# Altium schematic sheet CPU.SchDoc: CPU
size A4; CheckedBy: *Goran Vidakovic; CompanyName: Sigmoid DOO, Novi Sad, Serbia; DrawnBy: *Nikolina Bratic; SheetNumber: 3; SheetTotal: 4
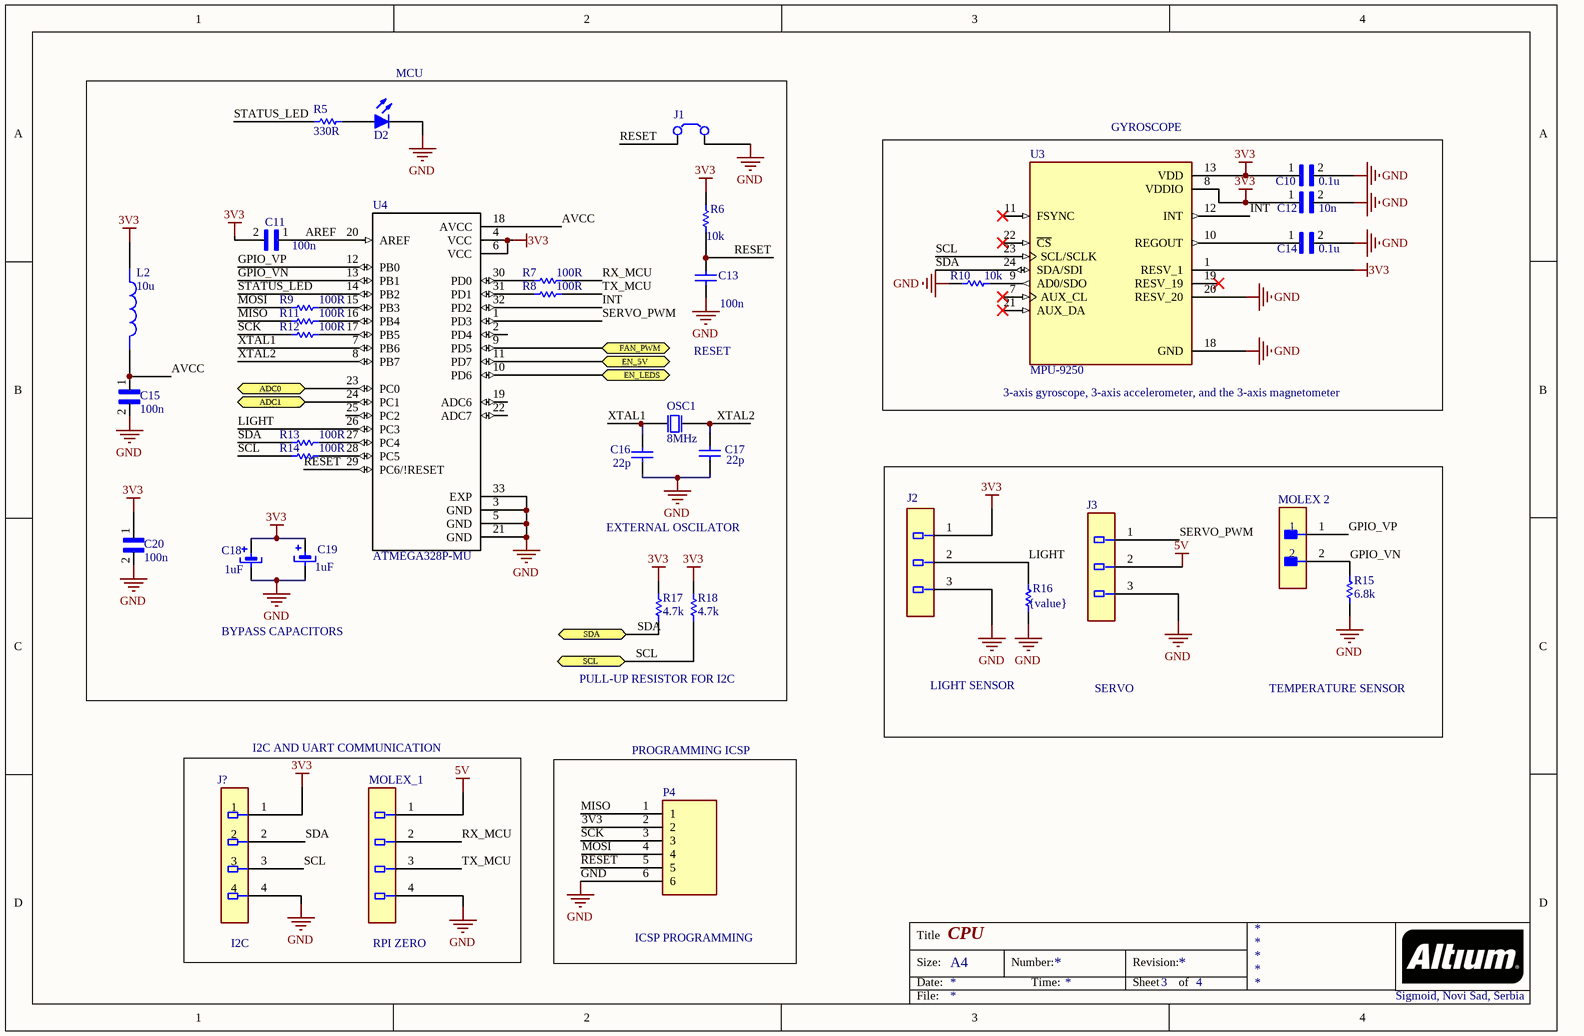
[diagram p0: CPU.SchDoc]

## Parts
C10  value 0.1u  [CAPC0402X22N]  (hidden comment: GRM0225C1E4R6CA03L_1)
C11  value 100n  [CAPC0402X22N]  (hidden comment: GRM0225C1E4R6CA03L_1)
C12  value 10n  [CAPC0402X22N]  (hidden comment: GRM0225C1E4R6CA03L_1)
C13  value 100n  [Capacitor SMD 0603]  (hidden comment: SMD Capacitor)
C14  value 0.1u  [CAPC0402X22N]  (hidden comment: GRM0225C1E4R6CA03L_1)
C15  value 100n  [CAPC0402X22N]  (hidden comment: GRM0225C1E4R6CA03L_1)
C16  value 22p  [Capacitor SMD 0603]  (hidden comment: SMD Capacitor)
C17  value 22p  [Capacitor SMD 0603]  (hidden comment: SMD Capacitor)
C18  value 1uF  [B Size Capacitor]  (hidden comment: SMD Tantalum Capacitor (B))
C19  value 1uF  [B Size Capacitor]  (hidden comment: SMD Tantalum Capacitor (B))
C20  value 100n  [CAPC0402X22N]  (hidden comment: GRM0225C1E4R6CA03L_1)
D2  SMD LED  [SMD LED Diode]  (value not drawn)
J1  Jumper 2 Pole  [Jumper 2 Pole]  (value not drawn)
J2  53253-0370  [Molex_53253-0370_0]  (value not drawn)
J3  SERVO CONNECTOR  [Molex_22-05-1032_0]  (value not drawn)
J?  Connector 4x1 1.27  [Harwin_Inc._M50-3930442_Recommended_Land_Pattern]  (value not drawn)
L2  value 10u  [INDC1608X95N]  (hidden comment: XAL6060-472ME)
MOLEX_1  292161-4  [TE_292161-4_0]  (value not drawn)
MOLEX_2  CONN HEADER VERT 2POS 2MM  [TE_Connectivity_0_MFG]  (value not drawn)
OSC1  value 8MHz  [XTAL_ECS-080-18-23G-JGN-TR]  (hidden comment: SMD Crystal Oscillator)
P4  ICSP PROGRAMMING  [ICSP Programming 6X1 (2mm)]
R5  value 330R  [RESC1005X35N]  (hidden comment: SMD Resistor)
R6  SMD Resistor  [Resistor SMD 0603]  (value not drawn)
R7  value 100R  [Resistor SMD 0603]  (hidden comment: SMD Resistor)
R8  value 100R  [Resistor SMD 0603]  (hidden comment: SMD Resistor)
R9  value 100R  [Resistor SMD 0603]  (hidden comment: SMD Resistor)
R10  value 10k  [Resistor SMD 0603]  (hidden comment: SMD Resistor)
R11  value 100R  [Resistor SMD 0603]  (hidden comment: SMD Resistor)
R12  value 100R  [Resistor SMD 0603]  (hidden comment: SMD Resistor)
R13  value 100R  [Resistor SMD 0603]  (hidden comment: SMD Resistor)
R14  value 100R  [Resistor SMD 0603]  (hidden comment: SMD Resistor)
R15  value 6.8k  [RESC1005X35N]  (hidden comment: SMD Resistor)
R16  value {value}  [Resistor SMD 0603]  (hidden comment: SMD Resistor)
R17  value 4.7k  [RESC1005X35N]  (hidden comment: SMD Resistor)
R18  value 4.7k  [RESC1005X35N]  (hidden comment: SMD Resistor)
U3  MPU-9250  [QFN40P300X300X105-24N]
U4  ATMEGA328P-MU  [QFN50P500X500X100-33N]

## Blocks framed on the sheet
GYROSCOPE: C10 C12 C14 R10 U3
PROGRAMMING ICSP: P4

## Ports
ADC0, ADC1, EN_5V, EN_LEDS, FAN_PWM, SCL, SDA

## Nets
3V3: C10.1 C11.2 C12.1 C18.1 C19.1 C20.1 J2.1 J?.1 L2.1 P4.2 R6.2 R17.2 R18.2 U3.1(RESV_1) U3.8(VDDIO) U3.13(VDD) U4.4(VCC) U4.6(VCC)
5V: J3.2 MOLEX_1.1
GND: C10.2 C12.2 C13.1 C14.2 C15.2 C16.1 C17.1 C18.2 C19.2 C20.2 D2.2(K) J1.2 J2.3 J3.3 J?.4 MOLEX_1.4 P4.6 R10.1 R15.1 R16.1 U3.18(GND) U3.20(RESV_20) U4.3(GND) U4.5(GND) U4.21(GND) U4.33(EXP)
ADC0: U4.23(PC0) ; port ADC0
ADC1: U4.24(PC1) ; port ADC1
AREF: C11.1 U4.20(AREF)
AVCC: C15.1 L2.2 U4.18(AVCC)
EN_5V: U4.11(PD7) ; port EN_5V
EN_LEDS: U4.10(PD6) ; port EN_LEDS
FAN_PWM: U4.9(PD5) ; port FAN_PWM
GPIO_VN: MOLEX_2.2 R15.2 U4.13(PB1)
GPIO_VP: MOLEX_2.1 U4.12(PB0)
INT: U3.12(INT) U4.32(PD2)
LIGHT: J2.2 R16.2 U4.26(PC3)
MISO: P4.1 R11.1
MOSI: P4.4 R9.1
RESET: C13.2 J1.1 P4.5 R6.1 U4.29(PC6/!RESET)
RX_MCU: MOLEX_1.2 R7.2
SCK: P4.3 R12.1
SCL: J?.3 R14.1 R18.1 U3.23(SCL/SCLK) ; port SCL
SDA: J?.2 R13.1 R17.1 U3.24(SDA/SDI) ; port SDA
SERVO_PWM: J3.1 U4.1(PD3)
STATUS_LED: R5.2 U4.14(PB2)
TX_MCU: MOLEX_1.3 R8.2
XTAL1: C16.2 OSC1.1(XTAL1) U4.7(PB6)
XTAL2: C17.2 OSC1.2(XTAL2) U4.8(PB7)
NetC14_1: C14.1 U3.10(REGOUT)
NetD2_1: D2.1(A) R5.1
NetR7_1: R7.1 U4.30(PD0)
NetR8_1: R8.1 U4.31(PD1)
NetR9_2: R9.2 U4.15(PB3)
NetR10_2: R10.2 U3.9(AD0/SDO)
NetR11_2: R11.2 U4.16(PB4)
NetR12_2: R12.2 U4.17(PB5)
NetR13_2: R13.2 U4.27(PC4)
NetR14_2: R14.2 U4.28(PC5)

Not connected (* = marked no-connect by the designer): U3 7(AUX_CL)* 11(FSYNC)* 19(RESV_19)* 21(AUX_DA)* 22(~{CS})*; U4 2(PD4) 19(ADC6) 22(ADC7) 25(PC2)

## Notes on the sheet
- (near D2) MCU
- RESET
- (near U3) 3-axis gyroscope, 3-axis accelerometer, and the 3-axis magnetometer
- EXTERNAL OSCILATOR
- BYPASS CAPACITORS
- PULL-UP RESISTOR FOR I2C
- LIGHT SENSOR
- SERVO
- TEMPERATURE SENSOR
- I2C AND UART COMMUNICATION
- (near J?) I2C
- (near MOLEX_1) RPI ZERO
- Sigmoid, Novi Sad, Serbia
- Title
- Size:
- Date:
- A4
- Number:
- Time:
- Revision:
- Sheet
- of
- File:
- (in symbol SMD Resistor) 10k

## Library data of the parts
C10-C12 C14 C15 C20 = GRM0225C1E4R6CA03L_1: SMD Capacitor C0G(EIA) with Capacitance: 4.6pF Tol. 0.25pF. Rated Voltage: 25Vdc; Package: None; Price: None; MP: GRM0225C1E4R6CA03L; Availability: Unavailable
C18 C19 = SMD Tantalum Capacitor (B)_1: Package: SMD 3528 (B)
D2 = SMD LED Diode: SMD LED (Red, Low Current Type)
J3 = 22-05-1032
J? = M50-3930442
L2 = XAL6060-472ME: Power inductor, shielded, 20% tol, SMT, RoHS, halogen f; Package: None; Price: None; MP: XAL6060-472ME; Availability: Unavailable
MOLEX_1 = 292161-4: Post Header Assembly, 4 Position, Vertical, 2mm Pitch, DIP Standard Type
MOLEX_2 = 53253-0270: Connector Header Through Hole 2 position 0.079" (2.00mm)
P4 = ICSP PROGRAMMING: POGO con6, pitch 2mm, Fi cc 1.5mm; MP: 2267063-6; Package: None; Price: None; Value: *; Availability: Unavailable
U3 = MPU-9250: Accelerometer, Gyroscope, Magnetometer, 9 Axis Sensor IÂ²C, SPI Output; MF: TDK InvenSense; SnapEDA_Link: https://www.snapeda.com/parts/MPU-9250/TDK%20InvenSense/view-part/4652549/?ref=snap; Value: *; MP: MPU-9250; Availability: Unavailable; Package: TFQFN-24 TDK InvenSense; Price: None
U4 = ATMEGA328P-MU: AVR AVRÂ® ATmega Microcontroller IC 8-Bit 20MHz 32KB (16K x 16) FLASH 32-VQFN (5x5); MF: Microchip; Value: *; Package: VQFN-32 Microchip; Price: None; MP: ATMEGA328P-MU; Availability: Good; SnapEDA_Link: https://www.snapeda.com/parts/ATMEGA328P-MU/Microchip/view-part/649548/?ref=snap; Check_prices: https://www.snapeda.com/parts/ATMEGA328P-MU/Microchip/view-part/649548/?ref=eda; Purchase-URL: https://pricing.snapeda.com/search/part/ATMEGA328P-MU/?ref=eda